# Altium schematic sheet RF Frontend v1.0.0.SchDoc: Probe-Scope Analog Frontend Test
size Letter; CompanyName: Probe-Scope; Organization: Probe-Scope; Address1: Probe-Scope: Unified USB; Address2: Oscilloscope Probe; Address3: ©2019 M. Omo, J. Rowley,; Address4: K. Hall, released under the; DocumentNumber: SCH0010; SheetNumber: 1; PageSetup: Record=PageOptions|CenterHorizontal=True|CenterVertical=True|PrintScale=0.96|XCorrection=1.00|YCorrection=1.00|PrintKind=1|BorderSize=5000000|LeftOffset=0|BottomOffset=0|Orientation=2|PaperLength=1000|PaperWidth=1000|Scale=100|PaperSource=7|PrintQuality=-4|MediaType=1|DitherType=10|PaperKind=11x17|PrintScaleMode=1; Assembly: ASP0010; License: CERN OHL v1.2
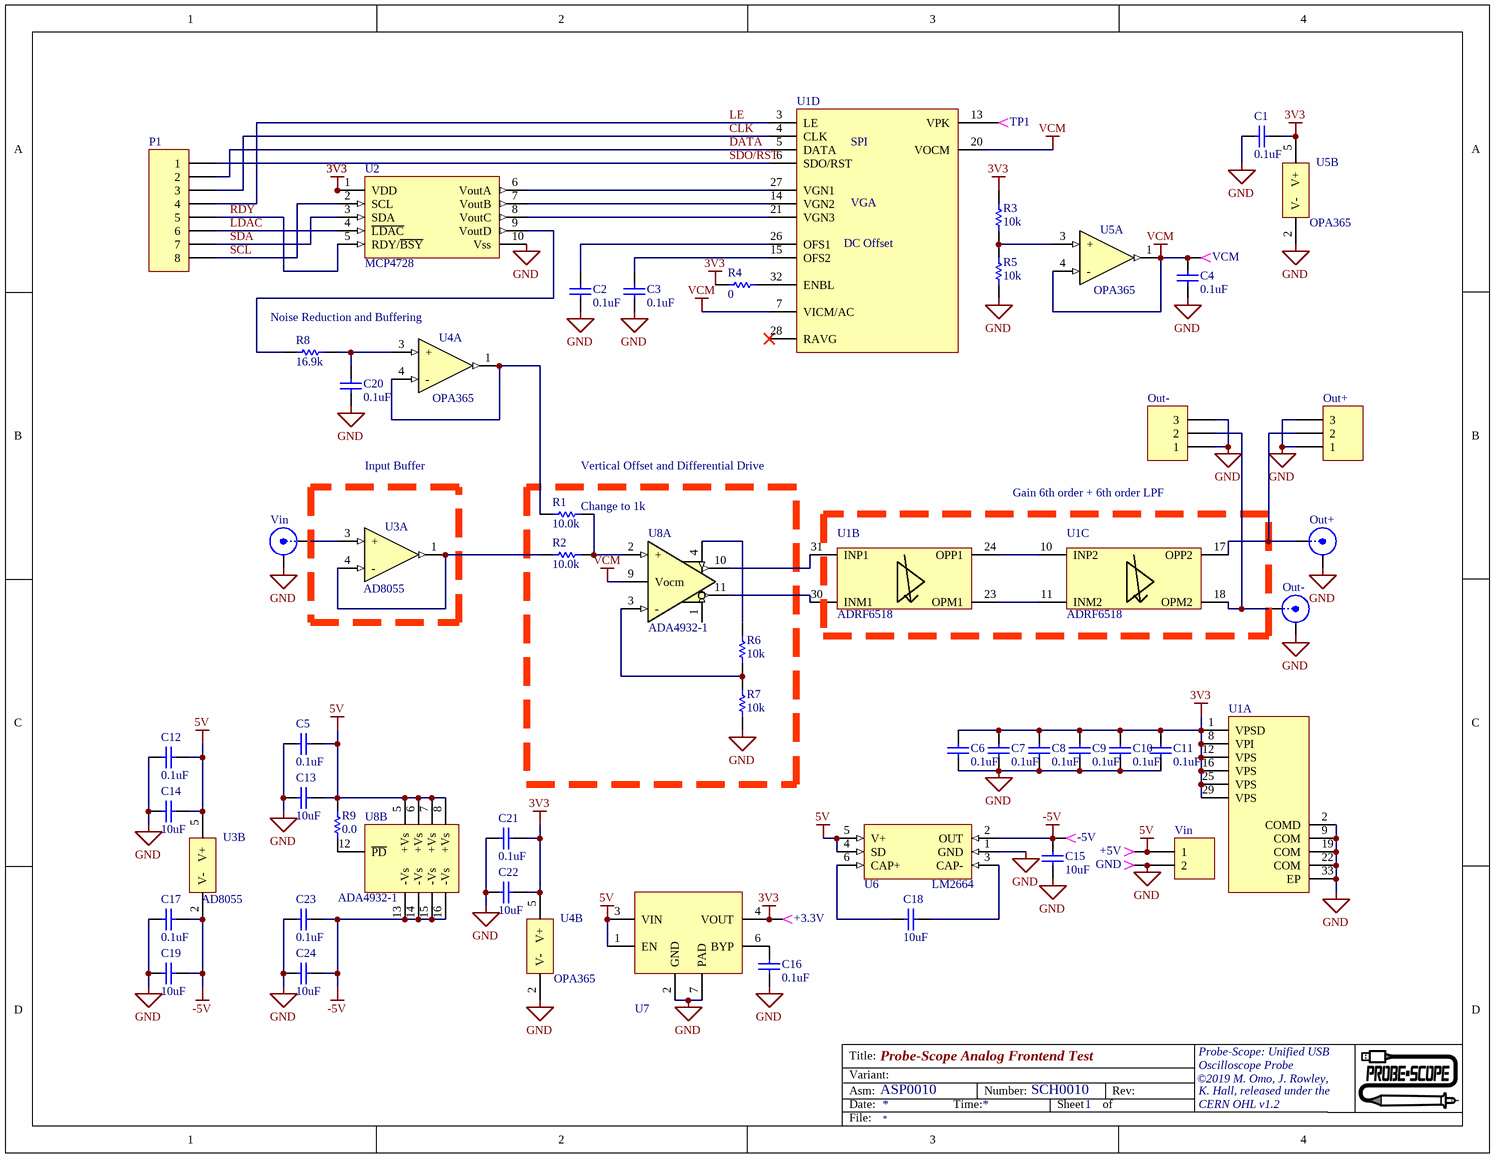
[diagram p0: RF Frontend v1.0.0.SchDoc]

## Parts
(Parts that share a designator on the sheet are numbered #1, #2 ... from top to bottom, then left to right.)
+3.3V  TP  [TESTPOINT062]  (value not drawn)
+5V  TP  [TESTPOINT062]  (value not drawn)
-5V  TP  [TESTPOINT062]  (value not drawn)
C1  value 0.1uF  [0402(1005)]  (hidden comment: Cap)
C2  value 0.1uF  [0402(1005)]  (hidden comment: Cap)
C3  value 0.1uF  [0402(1005)]  (hidden comment: Cap)
C4  value 0.1uF  [0402(1005)]  (hidden comment: Cap)
C5  value 0.1uF  [0402(1005)]  (hidden comment: Cap)
C6  value 0.1uF  [0402(1005)]  (hidden comment: Cap)
C7  value 0.1uF  [0402(1005)]  (hidden comment: Cap)
C8  value 0.1uF  [0402(1005)]  (hidden comment: Cap)
C9  value 0.1uF  [0402(1005)]  (hidden comment: Cap)
C10  value 0.1uF  [0402(1005)]  (hidden comment: Cap)
C11  value 0.1uF  [0402(1005)]  (hidden comment: Cap)
C12  value 0.1uF  [0402(1005)]  (hidden comment: Cap)
C13  value 10uF  [0603(1608)]  (hidden comment: 25V)
C14  value 10uF  [0603(1608)]  (hidden comment: 25V)
C15  value 10uF  [0603(1608)]  (hidden comment: 25V)
C16  value 0.1uF  [0402(1005)]  (hidden comment: Cap)
C17  value 0.1uF  [0402(1005)]  (hidden comment: Cap)
C18  value 10uF  [0603(1608)]  (hidden comment: 25V)
C19  value 10uF  [0603(1608)]  (hidden comment: 25V)
C20  value 0.1uF  [0402(1005)]  (hidden comment: Cap)
C21  value 0.1uF  [0402(1005)]  (hidden comment: Cap)
C22  value 10uF  [0603(1608)]  (hidden comment: 25V)
C23  value 0.1uF  [0402(1005)]  (hidden comment: Cap)
C24  value 10uF  [0603(1608)]  (hidden comment: 25V)
GND  TP  [TESTPOINT062]  (value not drawn)
Out+#1  0.1"  [0.1HDR1X3]  (value not drawn)
Out+#2  SMA  [TE SMA Stright]  (value not drawn)
Out-#1  0.1"  [0.1HDR1X3]  (value not drawn)
Out-#2  SMA  [TE SMA Stright]  (value not drawn)
P1  0.1" Vert  [0.1HDR1X8]  (value not drawn)
R1  value 10.0k  [0603(1608)]  (hidden comment: Res1)
R2  value 10.0k  [0603(1608)]  (hidden comment: Res1)
R3  value 10k  [0402(1005)]  (hidden comment: Res1)
R4  value 0  [0402(1005)]  (hidden comment: Res1)
R5  value 10k  [0402(1005)]  (hidden comment: Res1)
R6  value 10k  [0402(1005)]  (hidden comment: Res1)
R7  value 10k  [0402(1005)]  (hidden comment: Res1)
R8  value 16.9k  [0603(1608)]  (hidden comment: Res1)
R9  value 0.0  [0603(1608)]  (hidden comment: Res1)
TP1  TP  [TESTPOINT062]  (value not drawn)
U1  ADRF6518  [QFN50P500X500X80_HS-33L]  (value not drawn)  (parts A,B,C,D of 4)
U2  MCP4728  [MSOP-10]
U3  AD8055  [SOT95P280X145-5L]  (parts A,B of 2)
U4  OPA365  [SOT23-5]  (parts A,B of 2)
U5  OPA365  [SOT23-5]  (parts A,B of 2)
U6  LM2664  [SOT95P280X145-6N]
U7  MIC5353  [MLF22D-06]  (value not drawn)
U8  ADA4932-1  [QFN50P300X300X80_HS-17L]  (parts A,B of 2)
VCM  TP  [TESTPOINT062]  (value not drawn)
Vin#1  SMA  [TE SMA Stright]  (value not drawn)
Vin#2  0.1"  [0.1HDR1X2P]  (value not drawn)

## Blocks framed on the sheet
Input Buffer: U3
Gain 6th order + 6th order LPF: U1

## Nets
3V3: +3.3V.1 C1.2 C6.2 C7.2 C8.2 C9.2 C10.2 C11.2 C21.2 C22.2 R3.2 R4.1 U1.1(VPSD) U1.8(VPI) U1.12(VPS) U1.16(VPS) U1.25(VPS) U1.29(VPS) U2.1(VDD) U4.5(V+) U5.5(V+) U7.4(VOUT)
5V: +5V.1 C5.2 C12.2 C13.2 C14.2 R9.1 U3.5(V+) U6.4(SD) U6.5(V+) U7.1(EN) U7.3(VIN) U8.5(+Vs) U8.6(+Vs) U8.7(+Vs) U8.8(+Vs) Vin#2.1
-5V: -5V.1 C15.2 C17.2 C19.2 C23.2 C24.2 U3.2(V-) U6.2(OUT) U8.13(-Vs) U8.14(-Vs) U8.15(-Vs) U8.16(-Vs)
GND: C1.1 C2.1 C3.1 C4.1 C5.1 C6.1 C7.1 C8.1 C9.1 C10.1 C11.1 C12.1 C13.1 C14.1 C15.1 C16.1 C17.1 C19.1 C20.1 C21.1 C22.1 C23.1 C24.1 GND.1 Out+#1.1 Out+#1.3 Out+#2.2(Y) Out-#1.1 Out-#1.3 Out-#2.2(Y) R5.1 R7.1 U1.2(COMD) U1.9(COM) U1.19(COM) U1.22(COM) U1.33(EP) U2.10(Vss) U4.2(V-) U5.2(V-) U6.1(GND) U7.2(GND) U7.7(PAD) Vin#1.2(Y) Vin#2.2
VCM: C4.2 U1.7(VICM/AC) U1.20(VOCM) U5.1(OUT) U5.4(-) U8.9(Vocm) VCM.1
CL~{K}: P1.3 U1.4(CLK)
DATA: P1.2 U1.5(DATA)
~{LDAC}: P1.6 U2.4(~{LDAC})
LE: P1.4 U1.3(LE)
RDY: P1.5 U2.5(RDY/~{BSY})
SCL: P1.8 U2.2(SCL)
SDA: P1.7 U2.3(SDA)
SDO/RST: P1.1 U1.6(SDO/RST)
NetC2_2: C2.2 U1.26(OFS1)
NetC3_2: C3.2 U1.15(OFS2)
NetC16_2: C16.2 U7.6(BYP)
NetC18_1: C18.1 U6.6(CAP+)
NetC18_2: C18.2 U6.3(CAP-)
NetC20_2: C20.2 R8.2 U4.3(+)
NetOut+#1_2: Out+#1.2 Out+#2.1(X) U1.17(OPP2)
NetOut-#1_2: Out-#1.2 Out-#2.1(X) U1.18(OPM2)
NetR1_1: R1.1 U4.1(OUT) U4.4(-)
NetR1_2: R1.2 R2.2 U8.2(+)
NetR2_1: R2.1 U3.1(OUT) U3.4(-)
NetR3_1: R3.1 R5.2 U5.3(+)
NetR4_2: R4.2 U1.32(ENBL)
NetR6_1: R6.1 R7.2 U8.3(-)
NetR6_2: R6.2 U8.4(+FB)
NetR8_1: R8.1 U2.9(VoutD)
NetR9_2: R9.2 U8.12(~{PD})
NetTP1_1: TP1.1 U1.13(VPK)
NetU1_10: U1.10(INP2) U1.24(OPP1)
NetU1_11: U1.11(INM2) U1.23(OPM1)
NetU1_14: U1.14(VGN2) U2.7(VoutB)
NetU1_21: U1.21(VGN3) U2.8(VoutC)
NetU1_27: U1.27(VGN1) U2.6(VoutA)
NetU1_30: U1.30(INM1) U8.11(-Out)
NetU1_31: U1.31(INP1) U8.10(+out)
NetU3_3: U3.3(+) Vin#1.1(X)

Not connected (* = marked no-connect by the designer): U1 28(RAVG)*; U8 1(-FB)

## Notes on the sheet
- Noise Reduction and Buffering
- (near R1) Vertical Offset and Differential Drive
- (near R1) Change to 1k
- Title:
- Asm:
- Date:
- Variant:
- Time:
- Number:
- Sheet
- of
- Rev:
- File:
- (in symbol 1600, part D) SPI; DC Offset

## Library data of the parts
+3.3V +5V -5V GND TP1 VCM = 57: Key: 57; MENG_PN: CON00004; MANF: Keystone Electronics; MANF_PN: 5005; VENDOR: Digikey; VENDOR_PN: 5005K-ND; P&V Description: Connector, Test Point, Red, Loop, Thru Hole, 0.22", 0.063" Dia; Class: Connector; Other: Red, Loop, Thru Hole, 0.22", 0.063" Dia; Approved: True; Type: Test Point; SMD: False; Date Modified: 6/23/2009 1:59:56 PM; Parent Key: 57; Verified: True
C1-C12 C16 C17 C20 C21 C23 = 1603: Key: 1603; MENG_PN: ???1603; MANF: Samsung Electro-Mechanics; MANF_PN: CL05F104ZO5NNNC; VENDOR: Digikey; VENDOR_PN: 1276-1004-1-ND; P&V Description: Capacitor, Ceramic, 0.1uF, 16V, 20% Tol, 85C, 0402, SMD; Class: Capacitor; Type: Ceramic; Tolerance: 20; Voltage: 16; Max Temperature: 85; Approved: False; Package: 0402; SMD: True; Date Modified: 5/16/2019 9:44:17 PM; Modified By: momo; Parent Key: 1603; Verified: False
C13-C15 C18 C19 C22 C24 = 1306: Key: 1306; MENG_PN: ???1306; MANF: Samsung Electro-Mechanics; MANF_PN: CL10A106MA8NRNC; VENDOR: Digikey; VENDOR_PN: 1276-1869-1-ND; P&V Description: Capacitor, Ceramic, 10uF, 25V, 20% Tol, 85C, X5R, 0603, SMD; Class: Capacitor; Type: Ceramic; Other: X5R; Tolerance: 20; Voltage: 25; Max Temperature: 85; Approved: True; Package: 0603; SMD: True; Date Modified: 3/3/2015 11:08:29 AM; Modified By: sotterbacher; Parent Key: 1306; Verified: True
Out+#1 Out-#1 = 1134: Key: 1134; MENG_PN: ???1134; MANF: Harwin; MANF_PN: M20-9990346; VENDOR: Digikey; VENDOR_PN: 952-2264-ND; P&V Description: Connector, Header, 0.1", 3 Positions, Male, 0.1" Spacing, Vertical, Tin Plated; Class: Connector; Other: Vertical, Tin Plated; Positions: 3; Spacing: 0.1; Sex: Male; Approved: False; Type: Header, 0.1"; SMD: False; Date Modified: 7/21/2017 2:32:53 PM; Modified By: jrowly; Parent Key: 1134; Verified: False
Out+#2 Out-#2 Vin#1 = 968: Key: 968; MENG_PN: ???968; MANF: TE Connectivity; MANF_PN: 5-1814832-1; VENDOR: Digikey; VENDOR_PN: A97594-ND; P&V Description: Connector, SMA, 1 Positions, Female, Vertical.  50 Ohm.  3 GHz.; Class: Connector; Other: Vertical.  50 Ohm.  3 GHz.; Positions: 1; Sex: Female; Approved: True; Type: SMA; SMD: False; Date Modified: 5/28/2013 3:41:34 PM; Modified By: rlaity; Parent Key: 968; Verified: True
P1 = 53: Key: 53; MENG_PN: CON00006; MANF: Molex; VENDOR: Digikey; VENDOR_PN: WM6508-ND; P&V Description: Connector, Header, 0.1", 8 Positions, 0.1" Spacing, 4A, 250V, 0.24" Long, 0.125" Tail, 15u" Select Gold; Class: Connector; Other: 0.24" Long, 0.125" Tail, 15u" Select Gold; Current: 4; Voltage: 250; Positions: 8; Spacing: 0.1; Approved: False; MANF_PN: 22-28-4083; Type: Header, 0.1"; SMD: False; Date Modified: 7/21/2017 2:26:43 PM; Modified By: jrowly; Parent Key: 53; Verified: False
R1 R2 = 739: Key: 739; MENG_PN: ???739; MANF: Yageo; MANF_PN: RC0603FR-0710KL; VENDOR: Digikey; VENDOR_PN: 311-10.0KHRCT-ND; P&V Description: Resistor, Thick Film, 10.0k Ohms, 0.1W, 1% Tol, 50V, 0603, SMD; Class: Resistor; Tolerance: 1; Power: 0.1; Voltage: 50; Approved: True; Type: Thick Film; Package: 0603; SMD: True; Date Modified: 7/7/2012 11:51:31 AM; Modified By: pmarcus; Expr1026: 739; Parent Key: 739; Verified: True
R3 R5-R7 = 1605: Key: 1605; MENG_PN: ???1605; MANF: Stackpole Electronics; MANF_PN: RMCF0402FT10K0; VENDOR: Digikey; VENDOR_PN: RMCF0402FT10K0CT-ND; P&V Description: Resistor, Thick Film, 10k Ohms, 0.063W, 1% Tol, 0402, SMD; Class: Resistor; Tolerance: 1; Power: 0.063; Approved: False; Type: Thick Film; Package: 0402; SMD: True; Date Modified: 5/16/2019 9:57:19 PM; Modified By: momo; Expr1026: 1605; Parent Key: 1605; Verified: False
R4 = 1606: Key: 1606; MENG_PN: ???1606; MANF: Stackpole Electronics; MANF_PN: RMCF0402ZT0R00; VENDOR: Digikey; VENDOR_PN: RMCF0402ZT0R00CT-ND; P&V Description: Resistor, Thick Film, 0 Ohms, 0402, SMD; Class: Resistor; Approved: False; Type: Thick Film; Package: 0402; SMD: True; Date Modified: 5/16/2019 9:59:31 PM; Modified By: momo; Expr1026: 1606; Parent Key: 1606; Verified: False
R8 = 1011: Key: 1011; MENG_PN: ???1011; MANF: Panasonic; MANF_PN: ERJ-3EKF1692V; VENDOR: Digikey; VENDOR_PN: P16.9KHCT-ND; P&V Description: Resistor, Thick Film, 16.9k Ohms, 0.1W, 1% Tol, 0603, SMD; Class: Resistor; Tolerance: 1; Power: 0.1; Approved: True; Type: Thick Film; Package: 0603; SMD: True; Date Modified: 8/12/2013 4:27:29 PM; Modified By: sotterbacher; Expr1026: 1011; Parent Key: 1011; Verified: True
R9 = 742: Key: 742; MENG_PN: ???742; MANF: Rohm; MANF_PN: MCR03ERTJ000; VENDOR: Digikey; VENDOR_PN: RHM0.0CGCT-ND; P&V Description: Resistor, Thick Film, 0.0 Ohms, 0.1W, 75V, 20m Ohm Max, 0603, SMD; Class: Resistor; Other: 20m Ohm Max; Power: 0.1; Voltage: 75; Approved: True; Type: Thick Film; Package: 0603; SMD: True; Date Modified: 3/18/2015 2:54:24 PM; Modified By: pmarcus; Expr1026: 742; Parent Key: 742; Verified: True
U1 = 1600: Key: 1600; MENG_PN: ???1600; MANF: Analog Devices; MANF_PN: ADRF6518ACPZ-R7; VENDOR: Digikey; VENDOR_PN: ADRF6518ACPZ-R7CT-ND; P&V Description: IC, VGA, VGA , 0Hz ~ 1.1GHz, QFN-32, SMD; Class: IC; Other: VGA , 0Hz ~ 1.1GHz; Approved: False; Type: VGA; Package: QFN-32; SMD: True; Date Modified: 5/16/2019 5:57:00 PM; Modified By: momo; Parent Key: 1600; Verified: False
U2 = 1601: Key: 1601; MENG_PN: ???1601; MANF: Microchip; MANF_PN: MCP4728T-E/UN; VENDOR: Digikey; VENDOR_PN: MCP4728T-E/UNCT-ND; P&V Description: IC, DAC, 12 Bit, 4 Channel, MSOP-10, SMD; Class: IC; Other: 12 Bit, 4 Channel; Approved: False; Type: DAC; Package: MSOP-10; SMD: True; Date Modified: 5/16/2019 7:43:15 PM; Modified By: momo; Parent Key: 1601; Verified: False
U3 = 1599: Key: 1599; MENG_PN: ???1599; MANF: Analog Devices; MANF_PN: AD8055ARTZ-REEL7; VENDOR: Digikey; VENDOR_PN: AD8055ARTZ-REEL7CT-ND; P&V Description: IC, Op Amp, 300MHz, 1400V/µs, SOT-23-5, SMD; Class: IC; Other: 300MHz, 1400V/µs; Approved: False; Type: Op Amp; Package: SOT-23-5; SMD: True; Date Modified: 5/15/2019 9:24:30 PM; Modified By: momo; Parent Key: 1599; Verified: False
U4 U5 = 994: Key: 994; MENG_PN: ???994; MANF: Texas Instruments; MANF_PN: OPA365AIDBVR; VENDOR: Digikey; VENDOR_PN: 296-20645-1-ND; P&V Description: IC, Op Amp, IC OPAMP GP R-R 50MHZ SOT23-5, SOT-23-5, SMD; Class: IC; Other: IC OPAMP GP R-R 50MHZ SOT23-5; Approved: True; Type: Op Amp; Package: SOT-23-5; SMD: True; Date Modified: 7/11/2013 12:18:41 PM; Modified By: pmarcus; Parent Key: 994; Verified: True
U6 = 1602: Key: 1602; MENG_PN: ???1602; MANF: Texas Instruments; MANF_PN: LM2664M6X/NOPB; VENDOR: Digikey; VENDOR_PN: LM2664M6X/NOPBCT-ND; P&V Description: IC, Voltage Regulator, Charge Pump, Inverting, SOT-23-5, SMD; Class: IC; Other: Charge Pump, Inverting; Approved: False; Type: Voltage Regulator; Package: SOT-23-5; SMD: True; Date Modified: 5/16/2019 9:05:02 PM; Modified By: momo; Parent Key: 1602; Verified: False
U7 = 1419: Key: 1419; MENG_PN: ???1419; MANF: Microchip; MANF_PN: MIC5353-3.3YMT-TR; VENDOR: Digikey; VENDOR_PN: 576-3680-1-ND; P&V Description: IC, Voltage Regulator, ULDO, Low Noise, 500mA, 2.6-6Vin,, DFN-6, SMD; Class: IC; Other: ULDO, Low Noise, 500mA, 2.6-6Vin,; Approved: True; Supplier 1: Digi-Key; Supplier Part Number 1: 576-3680-1-ND; Type: Voltage Regulator; Package: DFN-6; SMD: True; Date Modified: 3/7/2016 8:56:01 AM; Modified By: rlaity; Parent Key: 1419; Verified: True
U8 = 1597: Key: 1597; MENG_PN: ???1597; MANF: Analog Devices; MANF_PN: ADA4932-1YCPZ-R7; VENDOR: Digikey; VENDOR_PN: ADA4932-1YCPZ-R7CT-ND; P&V Description: IC, Op Amp, Differential Amplifier, 3-11V, 2800V/µs, 560MHz, QFN-16, SMD; Class: IC; Other: Differential Amplifier, 3-11V, 2800V/µs, 560MHz; Approved: False; Type: Op Amp; Package: QFN-16; SMD: True; Date Modified: 5/26/2019 11:36:30 AM; Modified By: momo; Parent Key: 1597; Verified: False
Vin#2 = 375: Key: 375; MENG_PN: CON00068; MANF: Molex; VENDOR: Digikey; VENDOR_PN: WM2700-ND; P&V Description: Connector, Header, 0.1", 2 Positions, Male, 0.1" Spacing, 4A, 250V, 0.24" Long, 0.125" Tail, 15u Select Gold, Polarized, Locking Ramp; Class: Connector; Other: 0.24" Long, 0.125" Tail, 15u Select Gold, Polarized, Locking Ramp; Current: 4; Voltage: 250; Positions: 2; Spacing: 0.1; Sex: Male; Approved: False; MANF_PN: 22-11-2022; Type: Header, 0.1"; SMD: False; Date Modified: 7/21/2017 2:28:28 PM; Modified By: jrowly; Parent Key: 375; Verified: False